# EAGLE design one_channel (EAGLE 5.11)
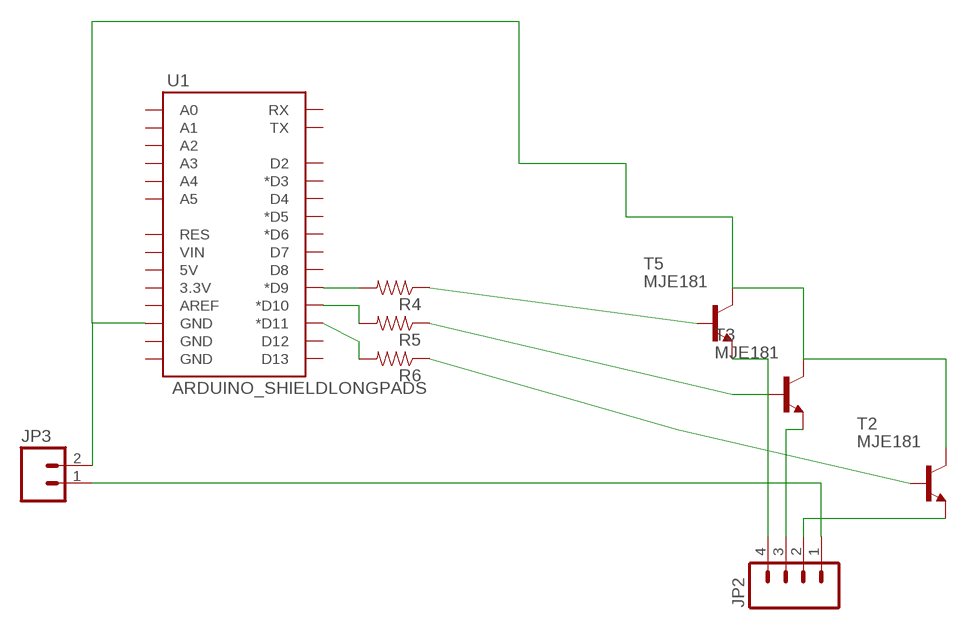
[diagram p0: schematic, sheet 1]

## Parts
JP2  M04LONGPADS  [1X04_LONGPADS]
JP3  M023.5MM_LOCK  [SCREWTERMINAL-3.5MM-2_LOCK]
R4  RESISTORPTH-1/4W  [AXIAL-0.4]
R5  RESISTORPTH-1/4W  [AXIAL-0.4]
R6  RESISTORPTH-1/4W  [AXIAL-0.4]
T2  MJE181  [TO225AA]
T3  MJE181  [TO225AA]
T5  MJE181  [TO225AA]
U1  ARDUINO_SHIELDLONGPADS  [DUEMILANOVE_SHIELD_LONGPADS]

## Nets
N$1: JP2.2 T2.1(E)
N$7: R4.P$2 U1.D9(*D9)
N$8: R5.P$2 U1.D10(*D10)
N$9: R4.P$1 T5.3(B)
N$10: R5.P$1 T3.3(B)
N$11: R6.P$2 U1.D11(*D11)
N$12: R6.P$1 T2.3(B)
N$13: JP3.2 T2.2(C) T3.2(C) T5.2(C) U1.GND@2(GND)
N$17: JP2.4 T5.1(E)
N$18: JP2.3 T3.1(E)
N$20: JP2.1 JP3.1
Unconnected: U1.3.3V U1.5V U1.A0 U1.A1 U1.A2 U1.A3 U1.A4 U1.A5 U1.AREF U1.D2 U1.D3(*D3) U1.D4 U1.D5(*D5) U1.D6(*D6) U1.D7 U1.D8 U1.D12 U1.D13 U1.GND@0(GND) U1.GND@1(GND) U1.RES U1.RX U1.TX U1.VIN

## Library data of the parts
JP2 = SparkFun:M04: Header 4 Standard 4-pin 0.1" header. Use with straight break away headers (SKU : PRT-00116), right angle break away headers (PRT-00553), swiss pins (PRT-00743), machine pins (PRT-00117), and female headers (PRT-00115). Molex polarized connector foot print use with SKU : PRT-08231 with associated crimp pins and housings. 1MM SMD Version SKU: PRT-10208
JP3 = SparkFun:M02: Header 2 Standard 2-pin 0.1" header. Use with straight break away headers (SKU : PRT-00116), right angle break away headers (PRT-00553), swiss pins (PRT-00743), machine pins (PRT-00117), and female headers (PRT-00115). Molex polarized connector foot print use with SKU : PRT-08233 with associated crimp pins and housings.
R4-R6 = SparkFun:RESISTOR: Resistor Basic schematic elements and footprints for 0603, 1206, and PTH resistors.
T2 T3 T5 = transistor:MJE181: NPN TRANSISTOR
U1 = SparkFun:ARDUINO_SHIELD

## Board
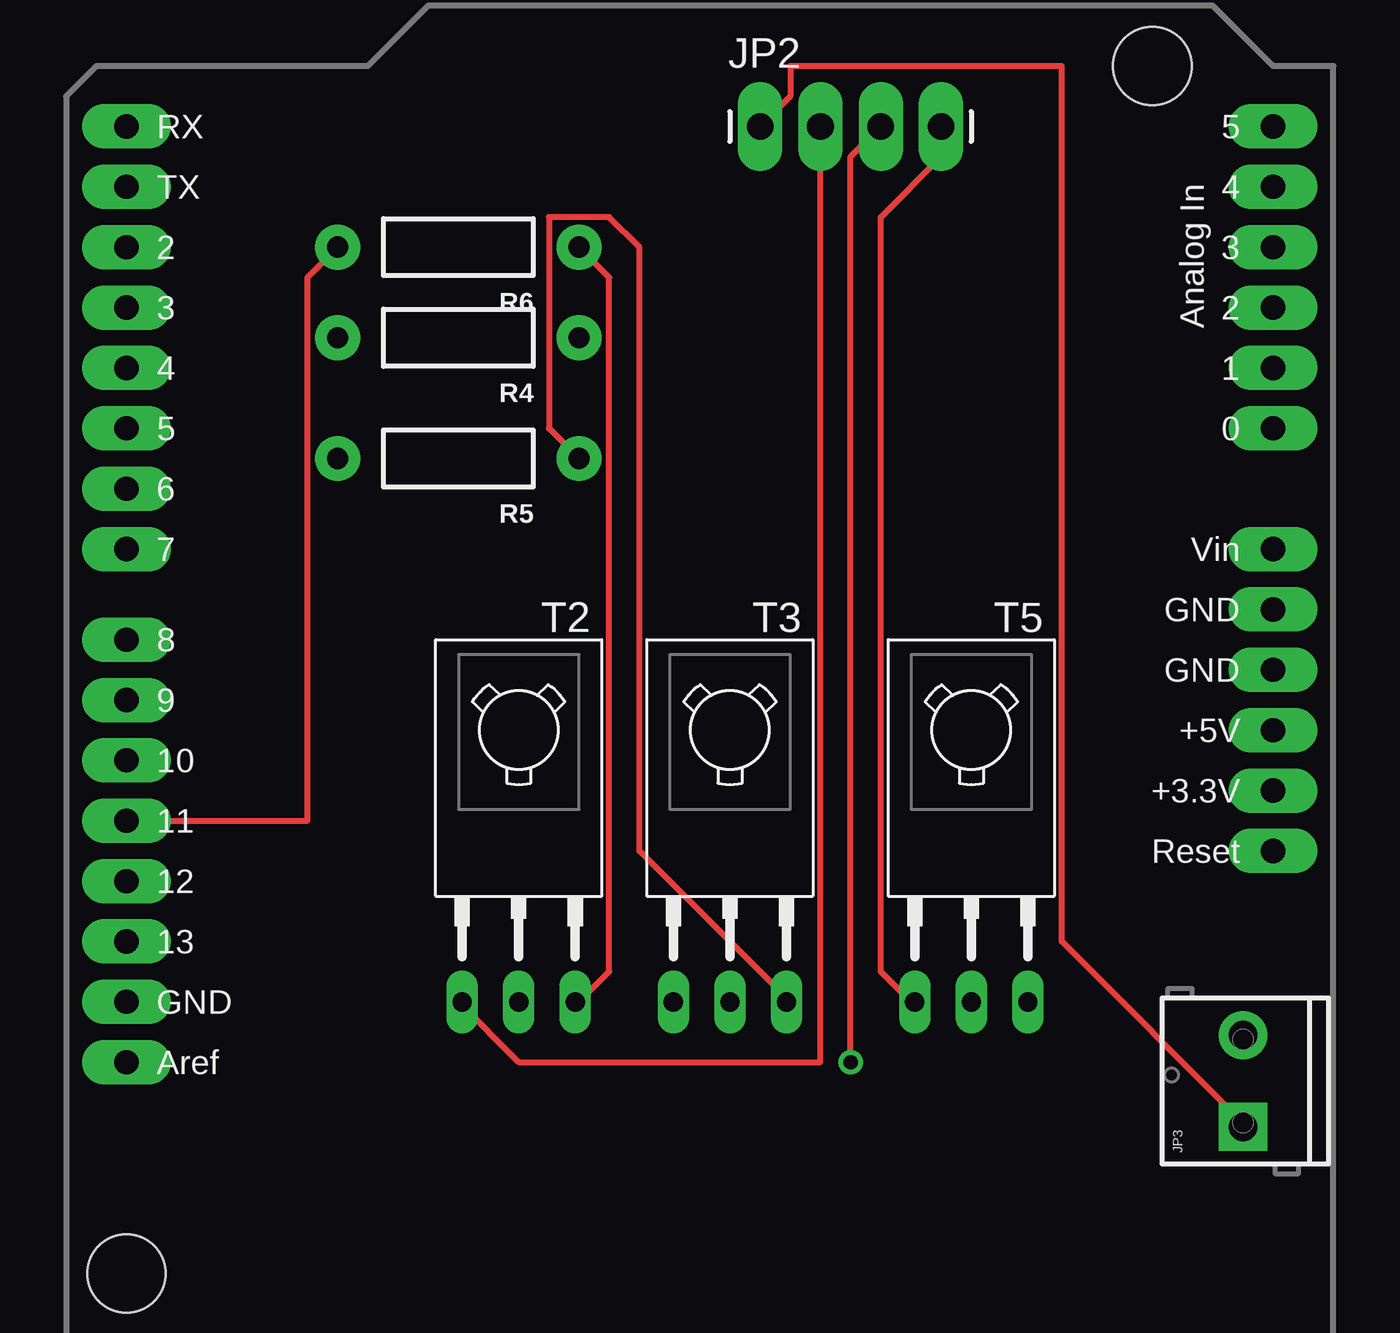
[diagram p1: board, top side]
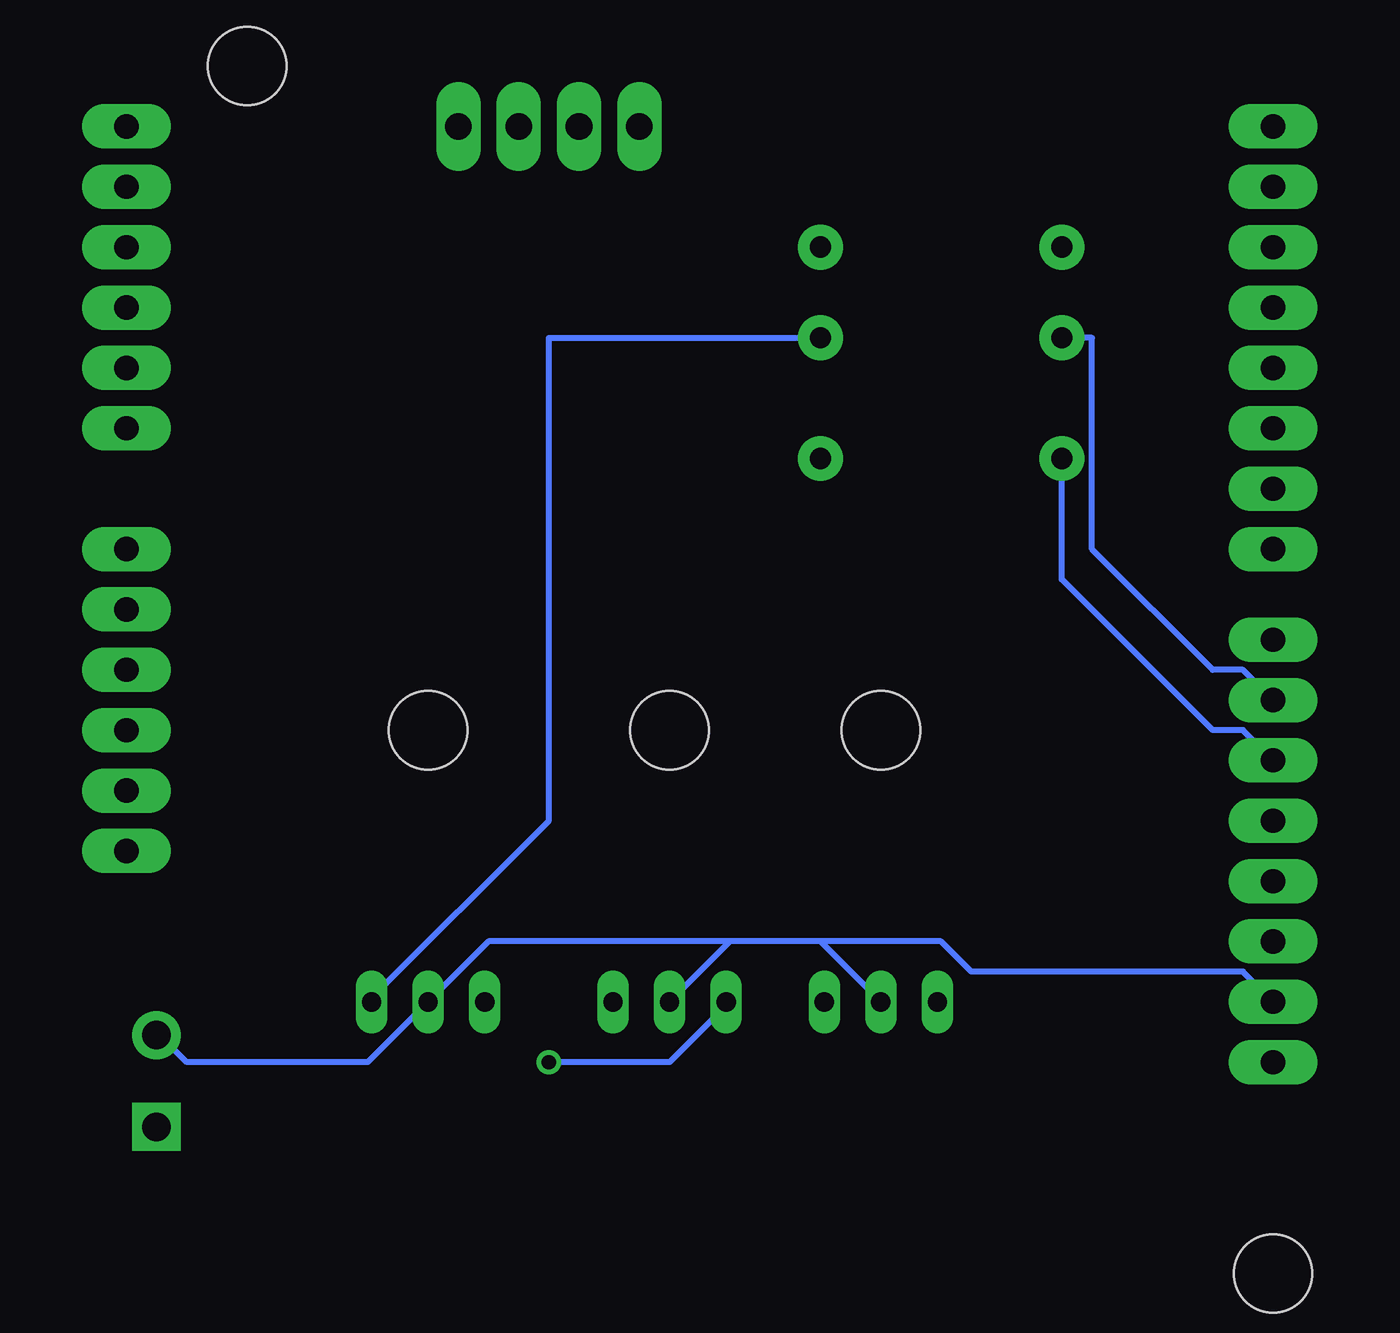
[diagram p2: board, bottom side, seen from below]

No outline drawn. Coordinates in mm, seen from the top.
Copper layers (1*16): Top 0.035mm / dielectric 1.5mm / Bottom 0.035mm
Design rules "default": minimum track width 10mil, minimum drill 24mil, track to track 8mil, track to pad 8mil, pad to pad 8mil, via to via 8mil, smd to smd 8mil, copper to edge 40mil, drill to drill 8mil, minimum pad ring 10mil, minimum via ring 8mil, stop-mask expansion 4mil, vias tented up to drill 0mil, thermal gap 10mil

### Footprints (pad centres in the part's own frame; a part is rotated, then mirrored left to right if it is on the bottom)
1X04_LONGPADS = drill 1.118 pad 1.88 long: 1 0,0; 2 2.54,0; 3 5.08,0; 4 7.62,0
SCREWTERMINAL-3.5MM-2_LOCK = drill 1.2 pad 2.032 square: 1 -0.178,0 | drill 1.2 pad 2.032 round: 2 3.678,0
AXIAL-0.4 = drill 0.9 pad 1.88 round: P$1 -5.08,0; P$2 5.08,0
TO225AA = drill 0.813 long: 1 -2.381,-11.43; 2 0,-11.43; 3 2.381,-11.43 | hole 3.302: 0,0
DUEMILANOVE_SHIELD_LONGPADS = drill 1.016 pad 1.88 long: 3.3V 50.8,26.67; 5V 50.8,29.21; A0 50.8,41.91; A1 50.8,44.45; A2 50.8,46.99; A3 50.8,49.53; A4 50.8,52.07; A5 50.8,54.61; AREF 2.54,15.24; D2 2.54,49.53; D3 2.54,46.99; D4 2.54,44.45; D5 2.54,41.91; D6 2.54,39.37; D7 2.54,36.83; D8 2.54,33.02; D9 2.54,30.48; D10 2.54,27.94; D11 2.54,25.4; D12 2.54,22.86; D13 2.54,20.32; GND@0 50.8,31.75; GND@1 50.8,34.29; GND@2 2.54,17.78; RES 50.8,24.13; RX 2.54,54.61; TX 2.54,52.07; VIN 50.8,36.83 | hole 3.302: 45.72,57.15; 2.54,6.35

### Placement (x,y rotation side)
JP2  53.34,72.39 0 top
JP3  73.66,30.48 90 top
R4  40.64,63.5 180 top
R5  40.64,58.42 180 top
R6  40.64,67.31 180 top
T2  43.18,46.99 0 top
T3  52.07,46.99 0 top
T5  62.23,46.99 0 top
U1  24.13,17.78 0 top

### Tracks (layer width: path | path; a pad name or v marks a point on that pad's centre or on a via)
N$1
  Top 0.254: JP2.2 55.88,33.02 43.18,33.02 40.64,35.56 T2.1
N$7
  Bottom 0.254: U1.D9 27.94,49.53 29.21,49.53 34.29,54.61 34.29,63.5 R4.P$2
N$8
  Bottom 0.254: U1.D10 27.94,46.99 29.21,46.99 35.56,53.34 R5.P$2
N$9
  Bottom 0.254: R4.P$1 57.15,63.5 57.15,43.18 64.77,35.56 T5.3
N$10
  Top 0.254: R5.P$1 44.45,59.69 44.45,68.58 46.99,68.58 48.26,67.31 48.26,41.91 54.61,35.56 T3.3
N$11
  Top 0.254: U1.D11 34.29,43.18 34.29,66.04 R6.P$2
N$12
  Top 0.254: R6.P$1 46.99,66.04 46.99,36.83 45.72,35.56 T2.3
N$13
  Bottom 0.254: 45.72,38.1 T2.2 | 45.72,38.1 49.53,38.1 | 49.53,38.1 T3.2 | 49.53,38.1 59.69,38.1 T5.2 64.77,33.02 72.39,33.02 73.66,34.29 JP3.2 | U1.GND@2 27.94,36.83 39.37,36.83 40.64,38.1 45.72,38.1
N$17
  Top 0.254: JP2.4 60.96,71.12 58.42,68.58 58.42,36.83 59.69,35.56 T5.1
N$18  (via drill 0.61)
  Top 0.254: v57.15,33.02 57.15,71.12 JP2.3
  Bottom 0.254: v57.15,33.02 52.07,33.02 49.53,35.56 T3.1
N$20
  Top 0.254: JP2.1 54.61,73.66 54.61,74.93 66.04,74.93 66.04,38.1 73.66,30.48 JP3.1